# EAGLE design cg2 (EAGLE 4.11)
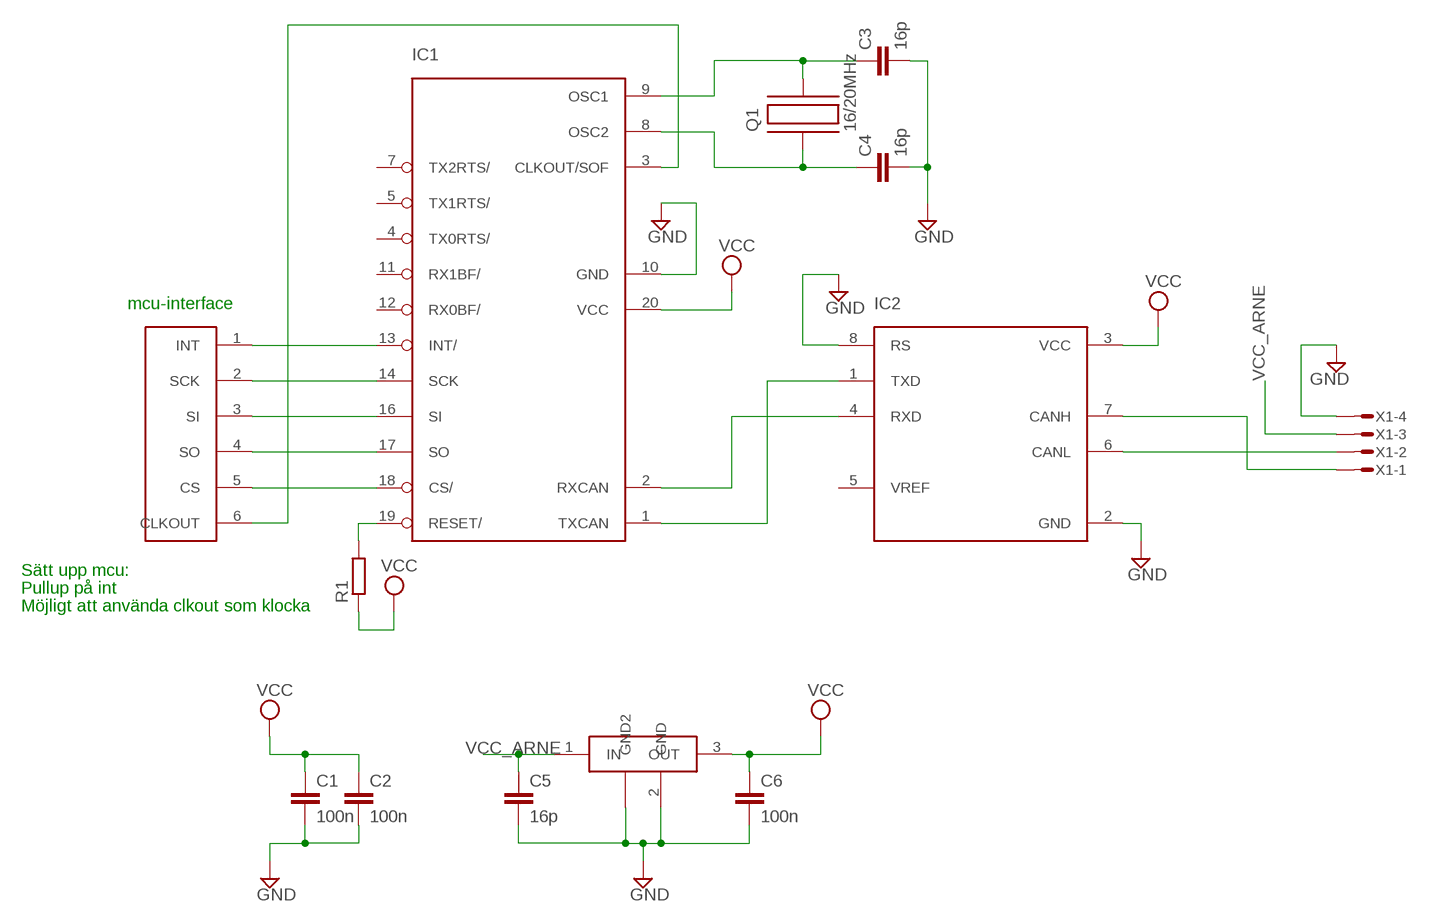
[diagram p0: schematic, sheet 1]

## Parts
C1  100n  C-EUC0603  [C0603]
C2  100n  C-EUC0603  [C0603]
C3  16p  C-EUC0603  [C0603]
C4  16p  C-EUC0603  [C0603]
C5  16p  C-EUC0603  [C0603]
C6  100n  C-EUC0603  [C0603]
IC1  MCP2515  [TSSOP]
IC2  MCP2551  [TSSOP]
LM340MP  LM340MP-5.0  [SOT223]
Q1  16/20MHz  C-MAC-LFA147E  [SMD]
R1  R-EU_R0603  [R0603]
U$1  CAN-INTERFACE  [VIA-LIST]
X1  MICROMATCH-4  [MICROMATCH-4-SMD]

## Nets
CANH: IC2.7(CANH) X1.1
CANL: IC2.6(CANL) X1.2
GND: C1.2 C2.2 C3.2 C4.2 C5.2 C6.2 IC1.10(GND) IC2.2(GND) IC2.8(RS) LM340MP.2(GND) LM340MP.4(GND2) X1.4
N$1: IC1.2(RXCAN) IC2.4(RXD)
N$2: IC1.1(TXCAN) IC2.1(TXD)
N$3: IC1.13(INT/) U$1.1(INT)
N$6: IC1.14(SCK) U$1.2(SCK)
N$7: IC1.16(SI) U$1.3(SI)
N$8: IC1.17(SO) U$1.4(SO)
N$9: IC1.3(CLKOUT/SOF) U$1.6(CLKOUT)
N$10: IC1.19(RESET/) R1.2
N$11: IC1.18(CS/) U$1.5(CS)
N$12: C3.1 IC1.9(OSC1) Q1.P$2
N$13: C4.1 IC1.8(OSC2) Q1.P$1
VCC: C1.1 C2.1 C6.1 IC1.20(VCC) IC2.3(VCC) LM340MP.3(OUT) R1.1
VCC_ARNE: C5.1 LM340MP.1(IN) X1.3
Unconnected: IC1.4(TX0RTS/) IC1.5(TX1RTS/) IC1.7(TX2RTS/) IC1.11(RX1BF/) IC1.12(RX0BF/) IC2.5(VREF)

## Notes on the sheet
- mcu-interface
- Sätt upp mcu:
- Pullup på int
- Möjligt att använda clkout som klocka

## Library data of the parts
C1-C6 = rcl:C-EU: CAPACITOR, European symbol
IC1 = mcp2515:MCP2515
IC2 = mcp2551:MCP2551
LM340MP = lm340mp:LM340MP-5.0
Q1 = hc49-4h-smx:C-MAC-LFA147E
R1 = rcl:R-EU_: RESISTOR, European symbol
U$1 = can-interface:CAN-INTERFACE
X1 = micromatch-smd:MICROMATCH-4: MicroMaTch 4 7-215464-4 / 0-215464-4 Drawing Number C-215464 DDEController.pdf

## Board
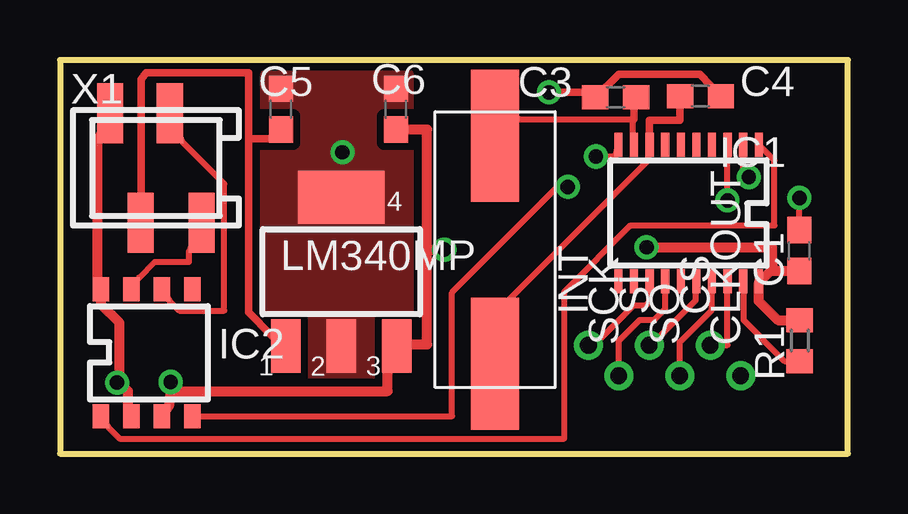
[diagram p1: board, top side]
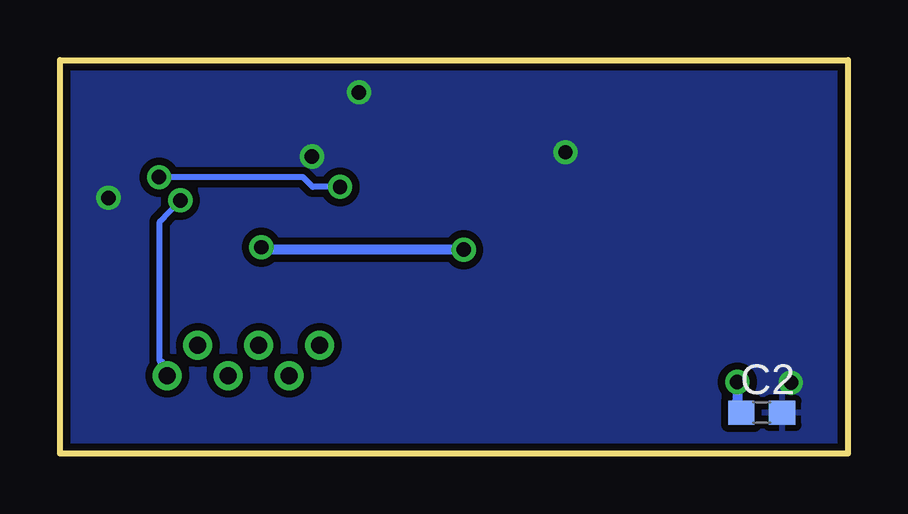
[diagram p2: board, bottom side, seen from below]

Size 32.85 x 16.4 mm. Coordinates in mm from the lower left corner, seen from the top.
Outline: 0,0 32.85,0 32.85,16.4 0,16.4 0,0
Copper layers (1*16): Top 0.035mm / dielectric 1.5mm / Bottom 0.035mm
Design rules "10mils, 0.6drill": minimum track width 10mil, minimum drill 0.6mm, track to track 10mil, track to pad 10mil, pad to pad 10mil, via to via 10mil, smd to smd 10mil, copper to edge 10mil, drill to drill 10mil, minimum pad ring 10mil, minimum via ring 8mil, stop-mask expansion 0mil, vias tented up to drill 0mil, thermal gap 10mil

### Footprints (pad centres in the part's own frame; a part is rotated, then mirrored left to right if it is on the bottom)
C0603 = smd 1.1 x 1: 1 -0.85,0; 2 0.85,0
TSSOP = smd 0.34 x 1: 1 -2.925,-2.85; 2 -2.275,-2.85; 3 -1.625,-2.85; 4 -0.975,-2.85; 5 -0.325,-2.85; 6 0.325,-2.85; 7 0.975,-2.85; 8 1.625,-2.85; 9 2.275,-2.85; 10 2.925,-2.85; 11 2.925,2.85; 12 2.275,2.85; 13 1.625,2.85; 14 0.975,2.85; 15 0.325,2.85; 16 -0.325,2.85; 17 -0.975,2.85; 18 -1.625,2.85; 19 -2.275,2.85; 20 -2.925,2.85
TSSOP' = smd 0.7 x 1: 1 -1.981,-2.645; 2 -0.711,-2.645; 3 0.559,-2.645; 4 1.829,-2.645; 5 1.829,2.645; 6 0.559,2.645; 7 -0.711,2.645; 8 -1.981,2.645
SOT223 = smd 1.219 x 2.235: 1 -2.311,-3.099; 2 0,-3.099; 3 2.311,-3.099 | smd 3.6 x 2.2: 4 0,3.099
SMD = smd 5.5 x 2: P$1 4.75,0; P$2 -4.75,0
R0603 = smd 1 x 1.1: 1 -0.85,0; 2 0.85,0
VIA-LIST = drill 0.7 round: 1 0,2.54; 2 -1.27,1.27; 3 0,0; 4 -1.27,-1.27; 5 0,-2.54; 6 -1.27,-3.81
MICROMATCH-4-SMD = smd 1.1 x 2.5: 1 1.905,-2.272; 2 0.585,2.272; 3 -0.635,-2.272; 4 -1.905,2.272

### Placement (x,y rotation side)
C1  30.82,8.46 90 top
C2  3.59,1.7 0 bottom
C3  23.17,14.85 180 top
C4  26.7,14.89 0 top
C5  9.22,14.35 90 top
C6  14.01,14.35 90 top
IC1  26.21,10.02 180 top
IC2  MCP2551  [TSSOP']  3.69,4.2 0 top
LM340MP  11.73,7.58 0 top
Q1  18.14,8.5 270 top
R1  30.84,4.71 270 top
U$1  24.57,4.52 90 top
X1  4,11.9 0 top

### Tracks (layer width: path | path; a pad name or v marks a point on that pad's centre or on a via)
CANH
  Top 0.254: IC2.7 3.29,7.33 3.95,7.99 5.38,7.99 5.38,8.39 X1.1
CANL
  Top 0.254: IC2.6 4.56,6.36 4.97,5.96 6.85,5.96 6.85,11.24 5.12,12.97 X1.2
GND  (via drill 0.6)
  Top 0.254: v22.34,12.38 23.16,12.38 IC1.10 | v30.83,10.66 30.83,9.79 C1.2 | 2.48,2.96 v2.38,2.96
  Top 0.305: IC2.2 2.84,1.99 | IC2.8 1.57,7.33 | C4.2 26.67,15.81 23.29,15.81 C3.2 22.15,15.05 v20.39,15.05
  Top 0.406: 2.84,1.99 2.84,2.6 2.48,2.96 2.48,5.45 1.72,6.21 IC2.8 | 1.57,7.33 1.57,12.97 X1.4
  Bottom 0.305: v20.39,15.05 20.34,15
  other vias: 11.78,12.55
  pour Bottom (isolate 0.305): -0.01,16.42 32.83,16.42 32.83,-0.03 24.38,-0.03 -0.01,-0.03
  pour Top (isolate 0.305, no thermals): 8.6,15.8 14.5,15.8 14.5,3.38 8.6,3.38
N$1  (via drill 0.6)
  Top 0.254: v21.18,11.11 20.74,11.11 16.35,6.72 16.35,1.56 5.83,1.56 IC2.4 | v28.72,11.52 28.49,11.75 IC1.2
  Bottom 0.254: v21.18,11.11 22.32,11.11 22.72,11.52 v28.72,11.52
N$2
  Top 0.254: IC2.1 2.02,1.08 2.48,0.62 21.02,0.62 21.02,6.74 23.79,9.51 29.79,9.51 29.79,12.22 IC1.1
N$3
  Top 0.254: U$1.1 22.25,4.52 23.92,6.19 24.43,6.19 24.58,6.34 24.58,7.05 IC1.13
N$6
  Top 0.254: U$1.2 23.29,4.7 24.17,5.58 24.78,5.58 25.24,6.03 25.24,7.05 25.19,7.1 25.23,7.14 IC1.14
N$7
  Top 0.254: U$1.3 24.64,4.52 26.51,6.39 26.51,7.15 IC1.16
N$8
  Top 0.254: U$1.4 25.84,4.65 27.17,5.98 27.17,7.1 27.18,7.11 IC1.17
N$9  (via drill 0.6)
  Top 0.254: v27.83,10.55 27.83,12.38 IC1.3
  Bottom 0.254: v27.83,10.55 28.69,9.66 28.69,3.85 28.59,3.85 U$1.6
N$10
  Top 0.254: R1.2 30.21,3.86 28.49,5.58 28.49,7.1 28.48,7.11 IC1.19
N$11
  Top 0.254: IC1.18 27.83,4.52 U$1.5
N$12
  Top 0.254: 23.87,13.93 23.87,13.35 IC1.9 | 23.87,13.93 19.14,13.93 Q1.P$2 | 23.87,13.93 23.92,13.93
  Top 0.305: C3.1 23.92,14.63 23.92,13.93
N$13
  Top 0.254: IC1.8 24.53,12.38 24.53,12.23 18.25,5.96 Q1.P$1
  Top 0.305: IC1.8 24.58,13.88 25.85,13.88 C4.1
VCC  (via drill 0.6)
  Top 0.254: 29.12,7.07 29.15,7.15 IC1.20 | 29.59,7.59 29.69,7.6 29.76,7.61 | 4.61,2.53 4.67,2.6
  Top 0.305: 13.66,3.37 LM340MP.3
  Top 0.406: C6.1 15.31,13.5 15.31,8.5 | 15.31,8.5 15.31,4.55 14.08,4.55 14.08,4.48 LM340MP.3 | R1.1 29.93,5.56 29.12,6.36 29.12,7.07 | 29.76,7.61 C1.1 | 29.59,7.59 29.15,7.15 | 4.67,2.6 13.66,2.6 13.66,3.37 | IC2.3 4.56,2.04 4.61,2.53 v4.61,2.98 | 15.31,8.5 v16.02,8.5 | 29.69,7.6 29.68,8.59 29.68,8.6 v24.45,8.6
  Bottom 0.254: 4.61,2.2 C2.1
  Bottom 0.406: v4.61,2.98 4.61,2.2 | v24.45,8.6 24.3,8.6 24.3,8.5 v16.02,8.5
VCC_ARNE
  Top 0.254: X1.3 3.4,10.83 | 7.86,13.22 7.86,13.12
  Top 0.305: C5.1 8.73,13.12 7.86,13.12 7.86,5.88 8.83,4.91 LM340MP.1 | 3.4,10.83 3.4,15.61 3.6,15.86 7.86,15.86 7.86,13.22